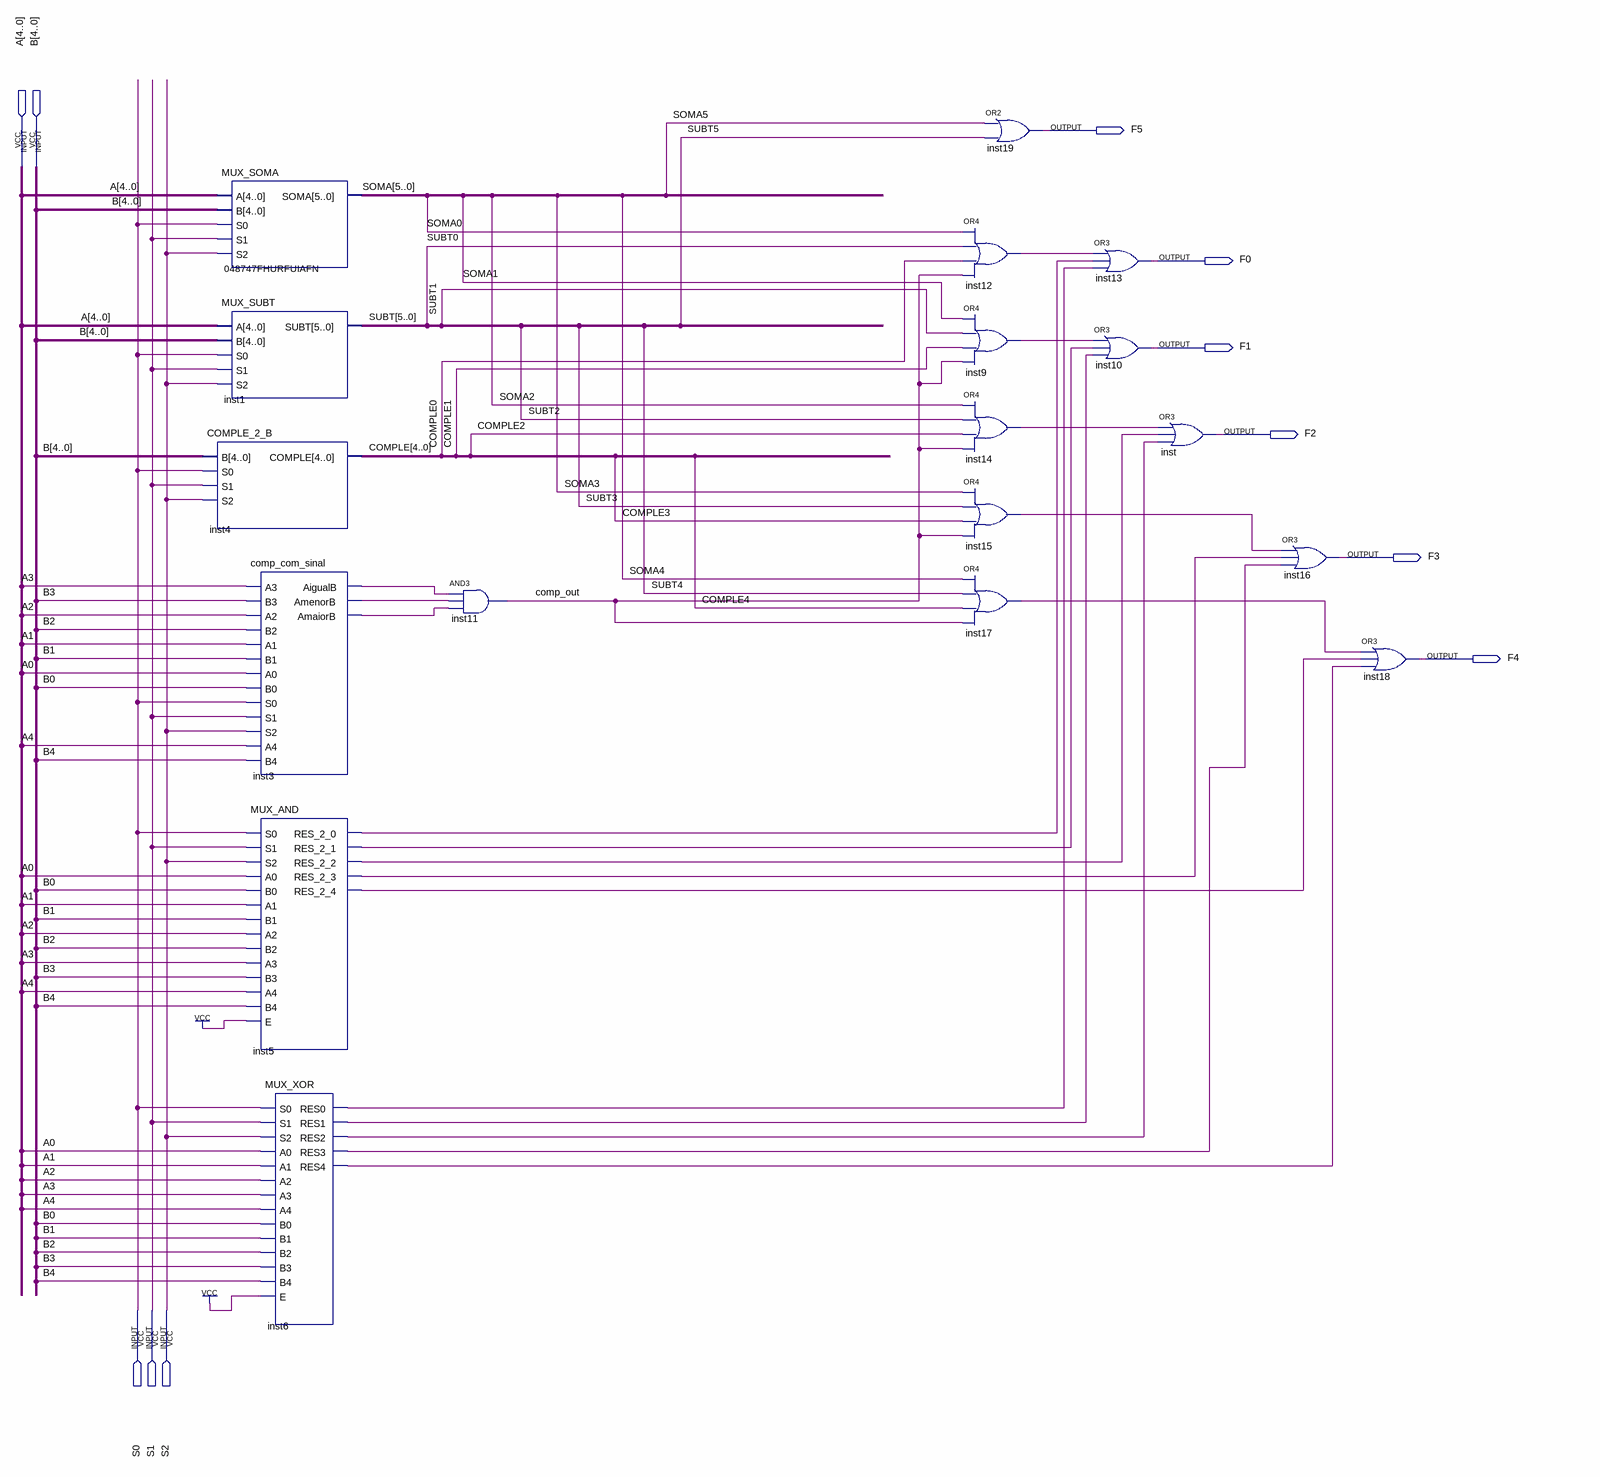
[diagram p0: schematic sheet]
// Quartus schematic MUX_FINAL.bdf as structural Verilog: 18 symbols, 11 pins
module MUX_FINAL (
  input  [4:0] A,
  input  [4:0] B,
  input  S0,
  input  S1,
  input  S2,
  output F5,
  output F0,
  output F1,
  output F2,
  output F3,
  output F4
);

  wire comp_out, inst3_aigualb, inst3_amaiorb, inst3_amenorb, inst5_res_2_0, inst5_res_2_1, inst5_res_2_2,
       inst5_res_2_3, inst5_res_2_4, inst6_res0, inst6_res1, inst6_res2, inst6_res3, inst6_res4, inst9_out,
       inst12_out, inst14_out, inst15_out, inst17_out;
  wire [4:0] COMPLE;
  wire [5:0] SOMA, SUBT;

  MUX_SOMA u_048747FHURFUIAFN (.A(A), .B(B), .S0(S0), .S1(S1), .S2(S2), .SOMA(SOMA));
  MUX_SUBT inst1 (.A(A), .B(B), .S0(S0), .S1(S1), .S2(S2), .SUBT(SUBT));
  COMPLE_2_B inst4 (.B(B), .S0(S0), .S1(S1), .S2(S2), .COMPLE(COMPLE));
  comp_com_sinal inst3 (
    .A3(A[3]), .B3(B[3]), .A2(A[2]), .B2(B[2]), .A1(A[1]), .B1(B[1]), .A0(A[0]), .B0(B[0]), .S0(S0), .S1(S1),
    .S2(S2), .A4(A[4]), .B4(B[4]), .AigualB(inst3_aigualb), .AmenorB(inst3_amenorb), .AmaiorB(inst3_amaiorb));
  MUX_AND inst5 (
    .S0(S0), .S1(S1), .S2(S2), .A0(A[0]), .B0(B[0]), .A1(A[1]), .B1(B[1]), .A2(A[2]), .B2(B[2]), .A3(A[3]),
    .B3(B[3]), .A4(A[4]), .B4(B[4]), .E(1'b1), .RES_2_0(inst5_res_2_0), .RES_2_1(inst5_res_2_1),
    .RES_2_2(inst5_res_2_2), .RES_2_3(inst5_res_2_3), .RES_2_4(inst5_res_2_4));
  MUX_XOR inst6 (
    .S0(S0), .S1(S1), .S2(S2), .A0(A[0]), .A1(A[1]), .A2(A[2]), .A3(A[3]), .A4(A[4]), .B0(B[0]), .B1(B[1]),
    .B2(B[2]), .B3(B[3]), .B4(B[4]), .E(1'b1), .RES0(inst6_res0), .RES1(inst6_res1), .RES2(inst6_res2),
    .RES3(inst6_res3), .RES4(inst6_res4));
  and inst11 (comp_out, inst3_aigualb, inst3_amenorb, inst3_amaiorb);
  or inst19 (F5, SOMA[5], SUBT[5]);
  or inst12 (inst12_out, SOMA[0], SUBT[0], COMPLE[0], comp_out);
  or inst9 (inst9_out, SOMA[1], SUBT[1], COMPLE[1], comp_out);
  or inst14 (inst14_out, SOMA[2], SUBT[2], COMPLE[2], comp_out);
  or inst15 (inst15_out, SOMA[3], SUBT[3], COMPLE[3], comp_out);
  or inst17 (inst17_out, SOMA[4], SUBT[4], COMPLE[4], comp_out);
  or inst13 (F0, inst12_out, inst5_res_2_0, inst6_res0);
  or inst10 (F1, inst9_out, inst5_res_2_1, inst6_res1);
  or inst (F2, inst14_out, inst5_res_2_2, inst6_res2);
  or inst16 (F3, inst15_out, inst5_res_2_3, inst6_res3);
  or inst18 (F4, inst17_out, inst5_res_2_4, inst6_res4);
endmodule
